# Altium schematic sheet ADC_Calibration.SchDoc
size Tabloid; SheetNumber: 6; SheetTotal: 7
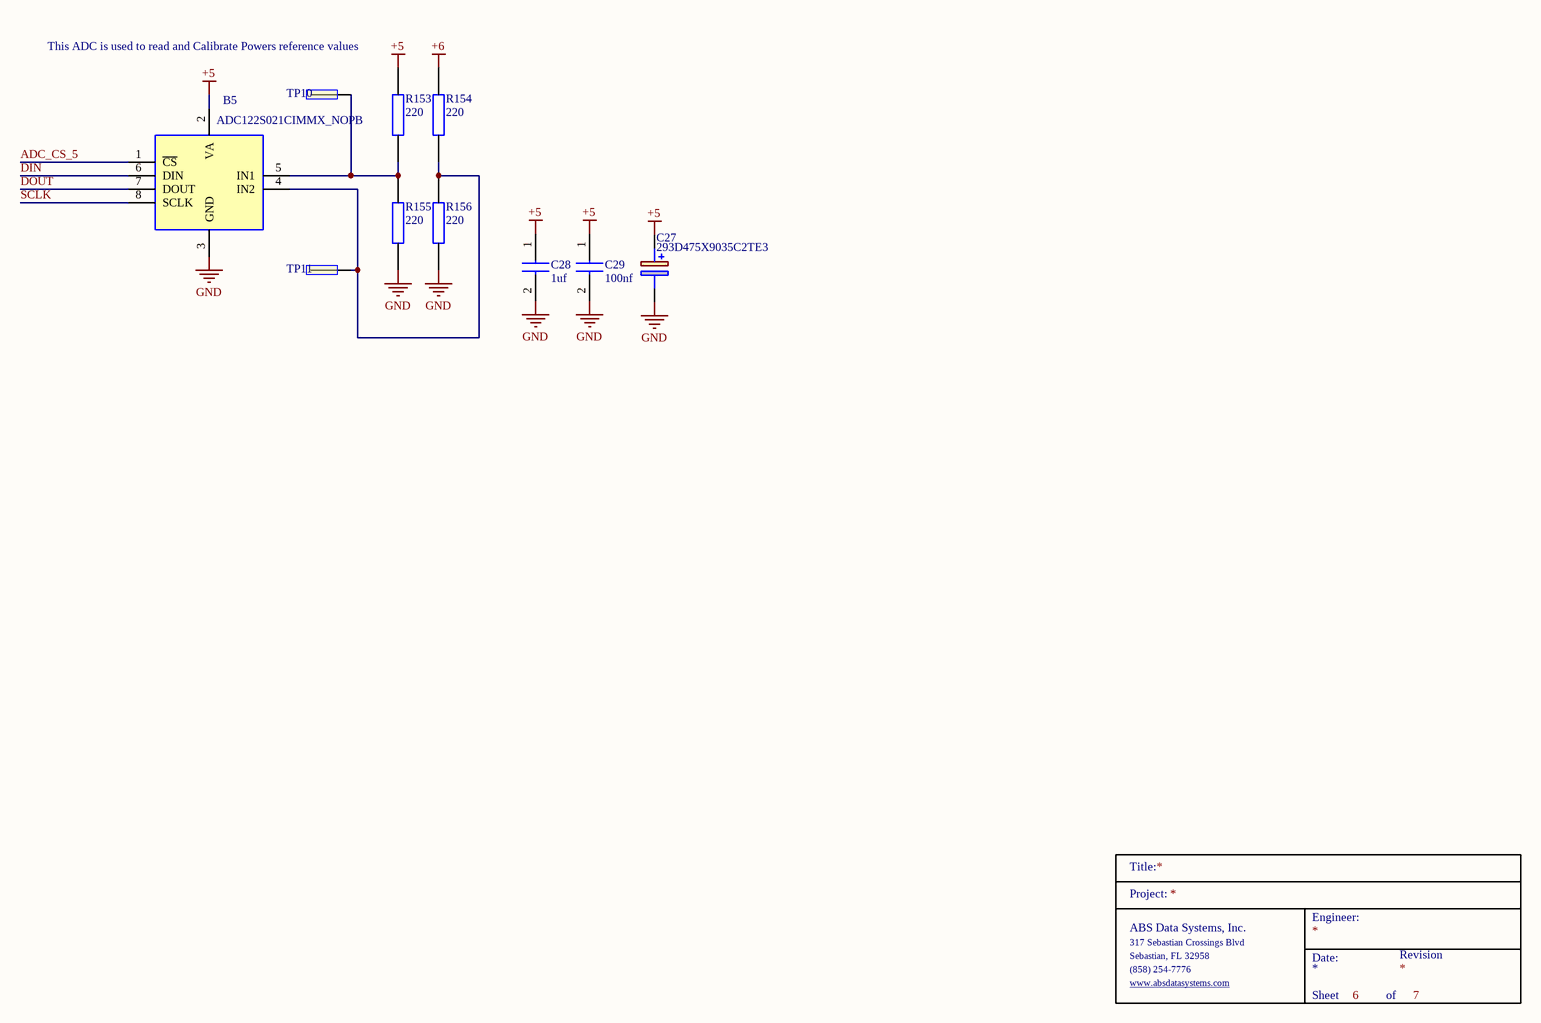
[diagram p0: ADC_Calibration.SchDoc]

## Parts
B5  ADC122S021CIMMX_NOPB  [SOP65P490X110-8N]
C27  293D475X9035C2TE3  [CAPPM6032X280N]
C28  1uf  [0603]
C29  100nf  [0603]
R153  220  [0603]
R154  220  [0603]
R155  220  [0603]
R156  220  [0603]
TitleBlock_6  TitleBlock  (value not drawn)  (graphical)
TP10  TP  [TP]  (value not drawn)
TP11  TP  [TP]  (value not drawn)

## Nets
+5: B5.2(VA) C27.1(+) C28.1 C29.1 R153.1
+6: R154.2
GND: B5.3(GND) C27.2(-) C28.2 C29.2 R155.1 R156.2
ADC_CS_5: B5.1(~{CS})
DIN: B5.6(DIN)
DOUT: B5.7(DOUT)
SCLK: B5.8(SCLK)
NetB5_4: B5.4(IN2) R154.1 R156.1 TP11.1
NetB5_5: B5.5(IN1) R153.2 R155.2 TP10.1

## Notes on the sheet
- This ADC is used to read and Calibrate Powers reference values
- (in symbol TitleBlock) Title:; Project:; Engineer:; ABS Data Systems, Inc.; 317 Sebastian Crossings Blvd; Sebastian, FL 32958; Date:; Revision; (858) 254-7776; www.absdatasystems.com; Sheet; of

## Library data of the parts
B5 = ADC122S021CIMMX_NOPB: 2 Channel, 50 ksps to 200 ksps 12-Bit A/D Converter; Manufacturer_Name: Texas Instruments; Manufacturer_Part_Number: ADC122S021CIMMX/NOPB; Geometry.Height: 1.1mm; Mouser Part Number: 926-A122S021CIMMXNPB; Mouser Price/Stock: https://www.mouser.co.uk/ProductDetail/Texas-Instruments/ADC122S021CIMMX-NOPB/?qs=7X5t%252BdzoRHB2bC7Teu8H3A%3D%3D; Datasheet Link: http://www.ti.com/lit/gpn/ADC122S021
C27 = 293D475X9035C2TE3: Solid Tantalum Surface Mount Chip Capacitors TANTAMOUNT(TM), Molded Case, Standard Industrial Grade; Manufacturer_Name: Vishay; Geometry.Height: 2.8mm; Mouser Part Number: 74-293D475X9035C2TE3; Mouser Price/Stock: https://www.mouser.co.uk/ProductDetail/Vishay-Sprague/293D475X9035C2TE3?qs=L4BSZja3YaK5uiX7PSIEuA%3D%3D; Manufacturer_Part_Number: 293D475X9035C2TE3; Datasheet Link: http://www.vishay.com/docs/40002/293d.pdf
C28 = CL10B105KA8NNNL: Samsung Electro-Mechanics 0603 1uf
C29 = CL10B104JB8NNNC: Samsung Electro-Mechanics 0603 100nf
R153-R156 = RC0603JR-07220RL: YAGEO 0603 220 ohm; Manufacturer_Name: KEMET; Manufacturer_Part_Number: RC0603JR-070RL; Geometry.Height: 0.55mm; Mouser Part Number: 603-RC0603JR-070RL; Mouser Price/Stock: https://www.mouser.co.uk/ProductDetail/YAGEO/RC0603JR-070RL?qs=2cAdsCoAWRGWyPcuXgGiXQ%3D%3D; Datasheet Link: https://datasheet.datasheetarchive.com/originals/distributors/Datasheets_SAMA/902f9e387b938f871d31120f5fc1d65e.pdf
TP10 TP11 = TP: Manufacturer: Samtec; Manufacturer Part Number: TST-105-01-G-D; Number of Contacts: 16; Gender: Male; Connector Type: Male Pin; Pitch: 2.54mm; Row Spacing: 0.1inch; Supplier 1: Digi-Key; RoHS: Yes; Category: Headers and Wire Housings; Stock 1: 227; Pricing 1: 1=2.85000, 10=2.73600, 100=2.28000, 500=1.93800, 1000=1.65300, 5000=1.48200 (USD); Mount: Through Hole; Contact Plating: Gold; Contact Material: Bronze; Housing Material: Polyester; Housing Color: Black; Color: Black; Min Operating Temperature: -55°C; Max Operating Temperature: 125°C; Number of Rows: 2; Termination: Solder; Packaging: Rail/Tube; Orientation: Straight; Number of Positions: 16; Length: 27.94mm; Depth: 9.27mm; Contact Mating Length: 0.25inch; REACH SVHC: No SVHC; ComponentLink1URL: https://datasheet.ciiva.com/739/tst-mkt-739845.pdf?src-supplier=Digi-Key; ComponentLink1Description: https://datasheet.ciiva.com/739/tst-mkt-739845.pdf?src-supplier=Digi-Key; ComponentLink2URL: https://datasheet.ciiva.com/10018/htst-10018510.pdf?src-supplier=Avnet; ComponentLink2Description: https://datasheet.ciiva.com/10018/htst-10018510.pdf?src-supplier=Avnet